# Altium schematic sheet 05-MCU_02.SchDoc
size A4; SheetNumber: 4; SheetTotal: 5
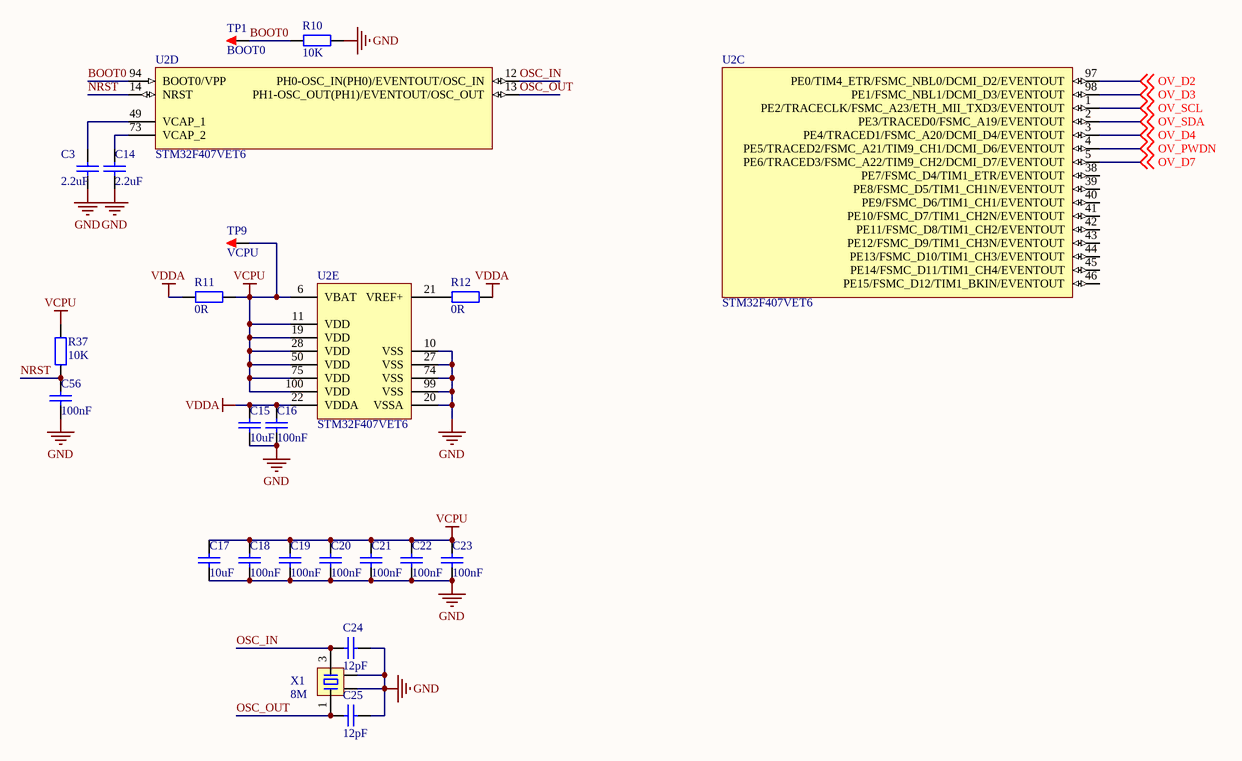
[diagram p0: 05-MCU_02.SchDoc]

## Parts
C3  2.2uF  [C0603_M]
C14  2.2uF  [C0603_M]
C15  10uF  [C0603_M]
C16  100nF  [C0603_M]
C17  10uF  [C0603_M]
C18  100nF  [C0603_M]
C19  100nF  [C0603_M]
C20  100nF  [C0603_M]
C21  100nF  [C0603_M]
C22  100nF  [C0603_M]
C23  100nF  [C0603_M]
C24  12pF  [C0603_M]
C25  12pF  [C0603_M]
C56  100nF  [C0603_M]
R10  10K  [R0603_M]
R11  0R  [R0603_M]
R12  0R  [R0603_M]
R37  10K  [R0603_M]
TP1  BOOT0  [TEST 1.6]
TP9  VCPU  [TEST 1.6]
U2  STM32F407VET6  [LQFP100_V]  (parts C,D,E of 5)
X1  8M  [XTAL-3225-4P]

## Nets
GND: C3.2 C14.2 C15.2 C16.2 C17.2 C18.2 C19.2 C20.2 C21.2 C22.2 C23.2 C24.2 C25.2 C56.2 R10.1 U2.10(VSS) U2.20(VSSA) U2.27(VSS) U2.74(VSS) U2.99(VSS) X1.2 X1.4
VCPU: C17.1 C18.1 C19.1 C20.1 C21.1 C22.1 C23.1 R11.1 R37.2 TP9.1 U2.6(VBAT) U2.11(VDD) U2.19(VDD) U2.28(VDD) U2.50(VDD) U2.75(VDD) U2.100(VDD)
VDDA: C15.1 C16.1 R11.2 R12.1 U2.22(VDDA)
BOOT0: R10.2 TP1.1 U2.94(BOOT0/VPP)
NRST: C56.1 R37.1 U2.14(NRST)
OSC_IN: C24.1 U2.12(PH0-OSC_IN(PH0)/EVENTOUT/OSC_IN) X1.3
OSC_OUT: C25.1 U2.13(PH1-OSC_OUT(PH1)/EVENTOUT/OSC_OUT) X1.1
OV_D2: U2.97(PE0/TIM4_ETR/FSMC_NBL0/DCMI_D2/EVENTOUT) ; off-sheet OV_D2
OV_D3: U2.98(PE1/FSMC_NBL1/DCMI_D3/EVENTOUT) ; off-sheet OV_D3
OV_D4: U2.3(PE4/TRACED1/FSMC_A20/DCMI_D4/EVENTOUT) ; off-sheet OV_D4
OV_D7: U2.5(PE6/TRACED3/FSMC_A22/TIM9_CH2/DCMI_D7/EVENTOUT) ; off-sheet OV_D7
OV_PWDN: U2.4(PE5/TRACED2/FSMC_A21/TIM9_CH1/DCMI_D6/EVENTOUT) ; off-sheet OV_PWDN
OV_SCL: U2.1(PE2/TRACECLK/FSMC_A23/ETH_MII_TXD3/EVENTOUT) ; off-sheet OV_SCL
OV_SDA: U2.2(PE3/TRACED0/FSMC_A19/EVENTOUT) ; off-sheet OV_SDA
NetC3_1: C3.1 U2.49(VCAP_1)
NetC14_1: C14.1 U2.73(VCAP_2)
NetR12_2: R12.2 U2.21(VREF+)

Not connected (* = marked no-connect by the designer): U2 38(PE7/FSMC_D4/TIM1_ETR/EVENTOUT) 39(PE8/FSMC_D5/TIM1_CH1N/EVENTOUT) 40(PE9/FSMC_D6/TIM1_CH1/EVENTOUT) 41(PE10/FSMC_D7/TIM1_CH2N/EVENTOUT) 42(PE11/FSMC_D8/TIM1_CH2/EVENTOUT) 43(PE12/FSMC_D9/TIM1_CH3N/EVENTOUT) 44(PE13/FSMC_D10/TIM1_CH3/EVENTOUT) 45(PE14/FSMC_D11/TIM1_CH4/EVENTOUT) 46(PE15/FSMC_D12/TIM1_BKIN/EVENTOUT)

## Library data of the parts
C3 C14-C25 C56 = C: 贴片电容/MLCC电容; BOM名称: 无极性贴片电容; 当前库版本V2023.8.14 @淘宝卖家:黄晶宝石: 最新版本发布https://item.taobao.com/item.htm?id=566775463719; 联系下单店铺卖家 免费帮你查找封装: 联系下单店铺卖家 免费技术支持
  C3 C14: value: 2.2uF
  C15 C17: value: 10uF
  C16 C18-C23 C56: value: 100nF
  C24 C25: value: 12pF
R10-R12 R37 = R: 贴片电阻; 联系下单店铺卖家 免费帮你查找封装: 联系下单店铺卖家 免费技术支持; BOM名称: 贴片电阻
  R10 R37: value: 10K
  R11 R12: value: 0R
TP1 TP9 = TEST: 测试点; 联系下单店铺卖家 免费技术支持: 联系下单店铺卖家 免费帮你查找封装; BOM名称: 测试点
U2 = STM32F407VET6: ARM Cortex-M4 32b MCU+FPU, 210DMIP, 512 kB Flash, 192+4 kB RAM, Camera, 82 I/Os, 100-pin LQFP, -40 to +85癈, Tray; Internal RAM: 192kB; Operating Frequency (Processor Speed): 168MHz; A/D Converter: 16x12-bit; D/A Converter: 2x12-bit; 16-bit Timers (IC/OC/PWM): 12x16-bit(24/24/30); 32-bit Timer (IC/OC/PWM): 2x32-bit (8/8/8); Other Timer Functions: 2xWDG, RTC, 24-bit down counter; Serial Interface: 3xSPI/2xI2S/2xI2C/3xUSART(IrDa, ISO7816)/3xUART/2xUSB OTG FS/HS, 2xCAN/Ethernet MAC10/100, SDIO; DatasheetVersion: rev2, Jan-2012; PackageVersion: 2012; PackageReference: LQFP100; PackageDescription: 100-Pin Low Profile Quad Flat Package, 14x14 mm Body, 0.5 mm Pitch; ComponentLink1Description: Manufacturer URL; ComponentLink1URL: http://www.st.com/; ComponentLink2Description: STM32F405/7 Datasheet; ComponentLink2URL: http://www.st.com/internet/com/TECHNICAL_RESOURCES/TECHNICAL_LITERATURE/DATASHEET/DM00037051.pdf; ComponentLink3Description: STM32F4 Web Page; ComponentLink3URL: http://www.st.com/internet/mcu/subclass/1521.jsp
X1 = XTAL-4P: 4脚无源晶振(谐振器）; 联系下单店铺卖家 免费帮你查找封装: 联系下单店铺卖家 免费技术支持; BOM名称: 4脚无源晶振(谐振器）